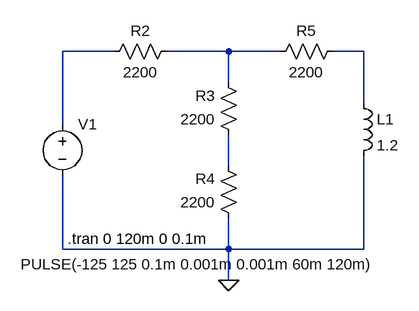
[diagram p0: schematic scheme.asc]
scheme.asc, the LTspice schematic file:
Version 4
SHEET 1 1008 680
WIRE 304 -128 224 -128
WIRE 480 -128 384 -128
WIRE 560 -128 480 -128
WIRE 688 -128 640 -128
WIRE 480 -80 480 -128
WIRE 688 -48 688 -128
WIRE 224 -16 224 -128
WIRE 480 48 480 0
WIRE 224 176 224 64
WIRE 480 176 480 128
WIRE 480 176 224 176
WIRE 688 176 688 32
WIRE 688 176 480 176
WIRE 480 224 480 176
FLAG 480 224 0
SYMBOL voltage 224 -32 R0
WINDOW 123 0 0 Left 0
WINDOW 39 0 0 Left 0
WINDOW 3 484 231 Right 2
SYMATTR InstName V1
SYMATTR Value PULSE(-125 125 0.1m 0.001m 0.001m 60m 120m)
SYMBOL ind 672 -64 R0
SYMATTR InstName L1
SYMATTR Value 1.2
SYMBOL res 400 -144 R90
WINDOW 0 0 56 VBottom 2
WINDOW 3 32 56 VTop 2
SYMATTR InstName R2
SYMATTR Value 2200
SYMBOL res 496 16 R180
WINDOW 0 36 76 Left 2
WINDOW 3 36 40 Left 2
SYMATTR InstName R3
SYMATTR Value 2200
SYMBOL res 496 144 R180
WINDOW 0 36 76 Left 2
WINDOW 3 36 40 Left 2
SYMATTR InstName R4
SYMATTR Value 2200
SYMBOL res 544 -112 R270
WINDOW 0 32 56 VTop 2
WINDOW 3 0 56 VBottom 2
SYMATTR InstName R5
SYMATTR Value 2200
TEXT 232 160 Left 2 !.tran 0 120m 0 0.1m

The netlist it stands for:
* scheme.asc
V1 N001 0 PULSE(-125 125 0.1m 0.001m 0.001m 60m 120m)
L1 N003 0 1.2
R2 N002 N001 2200
R3 N004 N002 2200
R4 0 N004 2200
R5 N002 N003 2200
.tran 0 120m 0 0.1m
.backanno
.end